# Altium schematic sheet synth.SchDoc: Synthesizer
size Letter; CheckedBy: J. Brinton; CompanyName: Signal Laboratories, Inc.; DrawnBy: J. Brinton; Engineer: J. Brinton; Address1: 3479 Edison Way; Address2: Menlo Park CA 94025; Address3: +1 (877) 778-8435; Address4: siglabs.com; Revision: 3; SheetNumber: 34; SheetTotal: 49
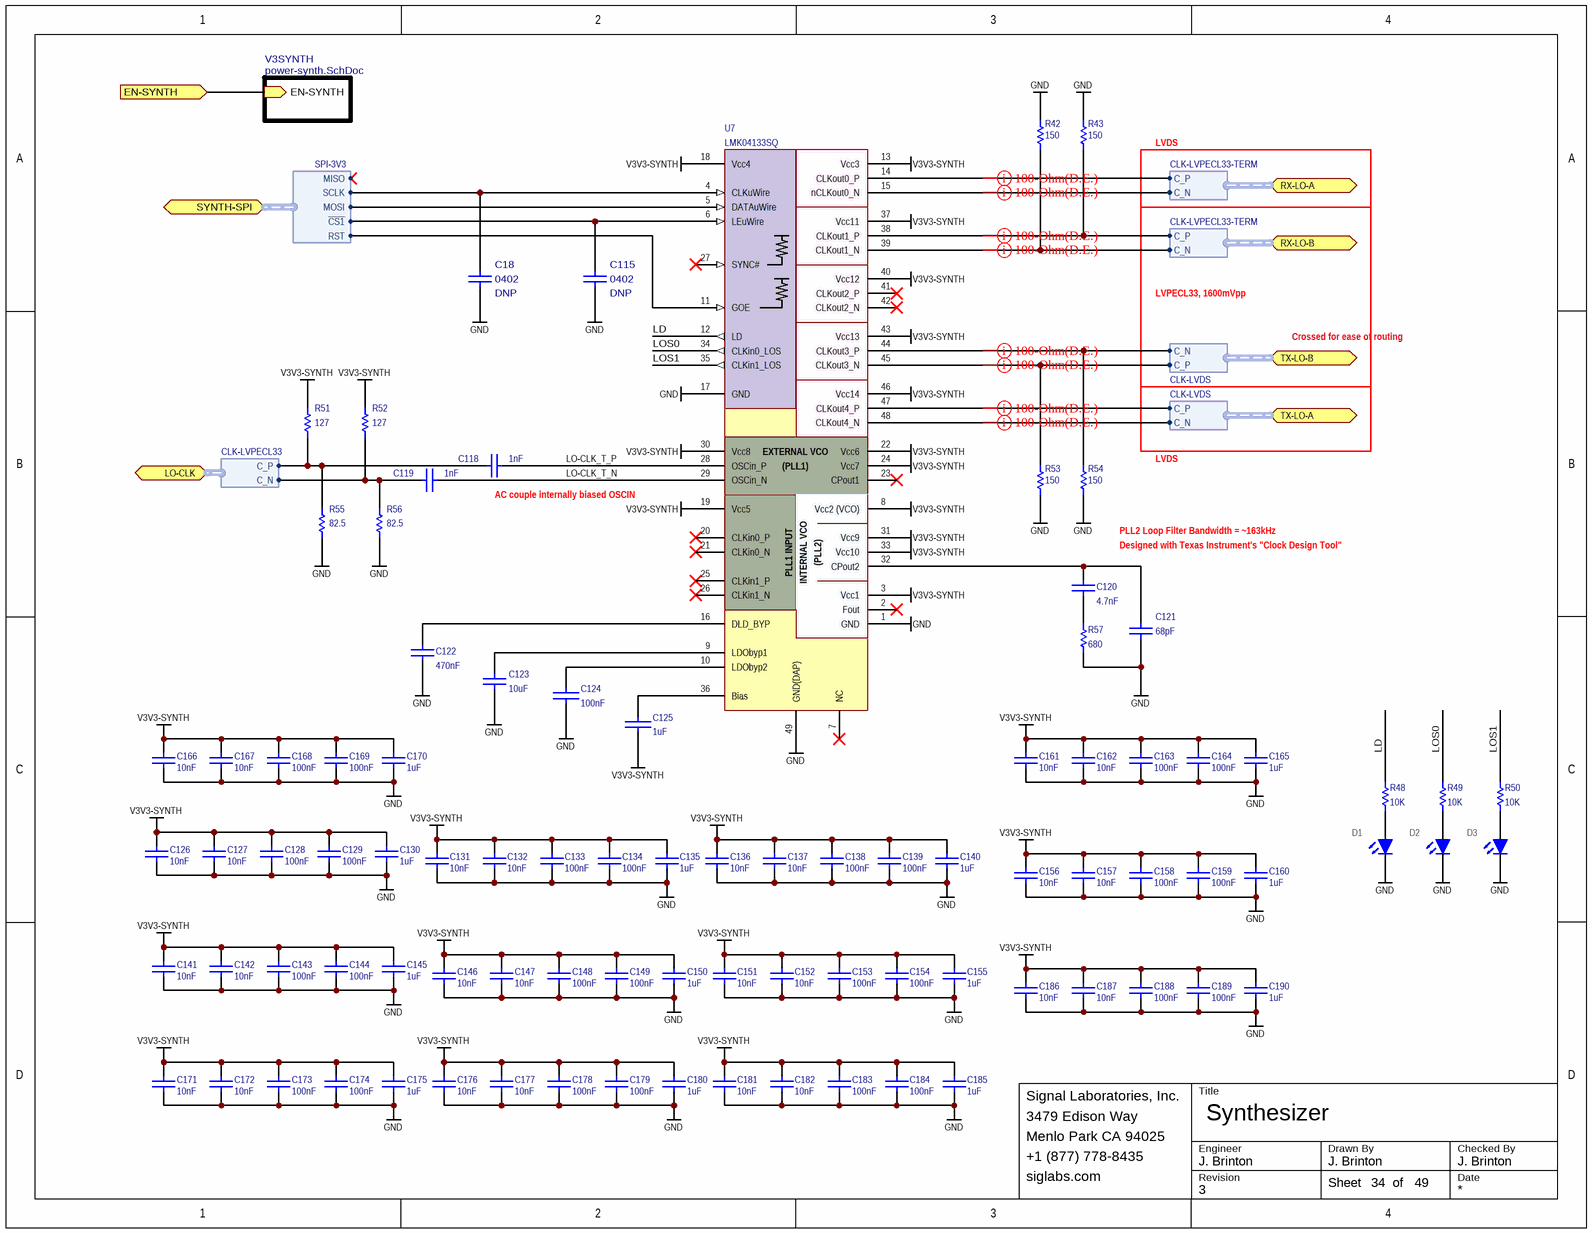
[diagram p0: synth.SchDoc]

## Parts
C18  Package: 0402  Do Not Place: DNP  [CAPC100X50X55L25N]  (hidden comment: VJ0402A101KXA)
C115  Package: 0402  Do Not Place: DNP  [CAPC100X50X55L25N]  (hidden comment: VJ0402A101KXA)
C118  value 1nF  [CAPC100X50X55L25N]  (hidden comment: CGA2B2NP01H102J050BA)
C119  value 1nF  [CAPC100X50X55L25N]  (hidden comment: CGA2B2NP01H102J050BA)
C120  value 4.7nF  [CAPC100X50X55L25N]  (hidden comment: GRM155R71H472JA01D)
C121  value 68pF  [CAPC100X50X55L25N]  (hidden comment: GRM1555C1H680GA01D)
C122  value 470nF  [CAPC200X125X145L45N]  (hidden comment: C0805C474K5RACTU)
C123  value 10uF  [CAPC160X80X90L20N]  (hidden comment: ZRB18AR61E106ME01L)
C124  value 100nF  [CAPC100X50X55L25N]  (hidden comment: GRM155R71C104KA88J)
C125  value 1uF  [CAPC100X50X55L25N]  (hidden comment: GRM155R61A105KE15)
C126  value 10nF  [CAPC100X50X55L25N]  (hidden comment: GRM155R71H103KA88)
C127  value 10nF  [CAPC100X50X55L25N]  (hidden comment: GRM155R71H103KA88)
C128  value 100nF  [CAPC100X50X55L25N]  (hidden comment: GRM155R71C104KA88J)
C129  value 100nF  [CAPC100X50X55L25N]  (hidden comment: GRM155R71C104KA88J)
C130  value 1uF  [CAPC100X50X55L25N]  (hidden comment: GRM155R61A105KE15)
C131  value 10nF  [CAPC100X50X55L25N]  (hidden comment: GRM155R71H103KA88)
C132  value 10nF  [CAPC100X50X55L25N]  (hidden comment: GRM155R71H103KA88)
C133  value 100nF  [CAPC100X50X55L25N]  (hidden comment: GRM155R71C104KA88J)
C134  value 100nF  [CAPC100X50X55L25N]  (hidden comment: GRM155R71C104KA88J)
C135  value 1uF  [CAPC100X50X55L25N]  (hidden comment: GRM155R61A105KE15)
C136  value 10nF  [CAPC100X50X55L25N]  (hidden comment: GRM155R71H103KA88)
C137  value 10nF  [CAPC100X50X55L25N]  (hidden comment: GRM155R71H103KA88)
C138  value 100nF  [CAPC100X50X55L25N]  (hidden comment: GRM155R71C104KA88J)
C139  value 100nF  [CAPC100X50X55L25N]  (hidden comment: GRM155R71C104KA88J)
C140  value 1uF  [CAPC100X50X55L25N]  (hidden comment: GRM155R61A105KE15)
C141  value 10nF  [CAPC100X50X55L25N]  (hidden comment: GRM155R71H103KA88)
C142  value 10nF  [CAPC100X50X55L25N]  (hidden comment: GRM155R71H103KA88)
C143  value 100nF  [CAPC100X50X55L25N]  (hidden comment: GRM155R71C104KA88J)
C144  value 100nF  [CAPC100X50X55L25N]  (hidden comment: GRM155R71C104KA88J)
C145  value 1uF  [CAPC100X50X55L25N]  (hidden comment: GRM155R61A105KE15)
C146  value 10nF  [CAPC100X50X55L25N]  (hidden comment: GRM155R71H103KA88)
C147  value 10nF  [CAPC100X50X55L25N]  (hidden comment: GRM155R71H103KA88)
C148  value 100nF  [CAPC100X50X55L25N]  (hidden comment: GRM155R71C104KA88J)
C149  value 100nF  [CAPC100X50X55L25N]  (hidden comment: GRM155R71C104KA88J)
C150  value 1uF  [CAPC100X50X55L25N]  (hidden comment: GRM155R61A105KE15)
C151  value 10nF  [CAPC100X50X55L25N]  (hidden comment: GRM155R71H103KA88)
C152  value 10nF  [CAPC100X50X55L25N]  (hidden comment: GRM155R71H103KA88)
C153  value 100nF  [CAPC100X50X55L25N]  (hidden comment: GRM155R71C104KA88J)
C154  value 100nF  [CAPC100X50X55L25N]  (hidden comment: GRM155R71C104KA88J)
C155  value 1uF  [CAPC100X50X55L25N]  (hidden comment: GRM155R61A105KE15)
C156  value 10nF  [CAPC100X50X55L25N]  (hidden comment: GRM155R71H103KA88)
C157  value 10nF  [CAPC100X50X55L25N]  (hidden comment: GRM155R71H103KA88)
C158  value 100nF  [CAPC100X50X55L25N]  (hidden comment: GRM155R71C104KA88J)
C159  value 100nF  [CAPC100X50X55L25N]  (hidden comment: GRM155R71C104KA88J)
C160  value 1uF  [CAPC100X50X55L25N]  (hidden comment: GRM155R61A105KE15)
C161  value 10nF  [CAPC100X50X55L25N]  (hidden comment: GRM155R71H103KA88)
C162  value 10nF  [CAPC100X50X55L25N]  (hidden comment: GRM155R71H103KA88)
C163  value 100nF  [CAPC100X50X55L25N]  (hidden comment: GRM155R71C104KA88J)
C164  value 100nF  [CAPC100X50X55L25N]  (hidden comment: GRM155R71C104KA88J)
C165  value 1uF  [CAPC100X50X55L25N]  (hidden comment: GRM155R61A105KE15)
C166  value 10nF  [CAPC100X50X55L25N]  (hidden comment: GRM155R71H103KA88)
C167  value 10nF  [CAPC100X50X55L25N]  (hidden comment: GRM155R71H103KA88)
C168  value 100nF  [CAPC100X50X55L25N]  (hidden comment: GRM155R71C104KA88J)
C169  value 100nF  [CAPC100X50X55L25N]  (hidden comment: GRM155R71C104KA88J)
C170  value 1uF  [CAPC100X50X55L25N]  (hidden comment: GRM155R61A105KE15)
C171  value 10nF  [CAPC100X50X55L25N]  (hidden comment: GRM155R71H103KA88)
C172  value 10nF  [CAPC100X50X55L25N]  (hidden comment: GRM155R71H103KA88)
C173  value 100nF  [CAPC100X50X55L25N]  (hidden comment: GRM155R71C104KA88J)
C174  value 100nF  [CAPC100X50X55L25N]  (hidden comment: GRM155R71C104KA88J)
C175  value 1uF  [CAPC100X50X55L25N]  (hidden comment: GRM155R61A105KE15)
C176  value 10nF  [CAPC100X50X55L25N]  (hidden comment: GRM155R71H103KA88)
C177  value 10nF  [CAPC100X50X55L25N]  (hidden comment: GRM155R71H103KA88)
C178  value 100nF  [CAPC100X50X55L25N]  (hidden comment: GRM155R71C104KA88J)
C179  value 100nF  [CAPC100X50X55L25N]  (hidden comment: GRM155R71C104KA88J)
C180  value 1uF  [CAPC100X50X55L25N]  (hidden comment: GRM155R61A105KE15)
C181  value 10nF  [CAPC100X50X55L25N]  (hidden comment: GRM155R71H103KA88)
C182  value 10nF  [CAPC100X50X55L25N]  (hidden comment: GRM155R71H103KA88)
C183  value 100nF  [CAPC100X50X55L25N]  (hidden comment: GRM155R71C104KA88J)
C184  value 100nF  [CAPC100X50X55L25N]  (hidden comment: GRM155R71C104KA88J)
C185  value 1uF  [CAPC100X50X55L25N]  (hidden comment: GRM155R61A105KE15)
C186  value 10nF  [CAPC100X50X55L25N]  (hidden comment: GRM155R71H103KA88)
C187  value 10nF  [CAPC100X50X55L25N]  (hidden comment: GRM155R71H103KA88)
C188  value 100nF  [CAPC100X50X55L25N]  (hidden comment: GRM155R71C104KA88J)
C189  value 100nF  [CAPC100X50X55L25N]  (hidden comment: GRM155R71C104KA88J)
C190  value 1uF  [CAPC100X50X55L25N]  (hidden comment: GRM155R61A105KE15)
D1  LNJ237W82RA  [0603_LED]  (value not drawn)
D2  LNJ237W82RA  [0603_LED]  (value not drawn)
D3  LNJ237W82RA  [0603_LED]  (value not drawn)
R42  value 150  [RESC1005X40N]  (hidden comment: ERJ-2RKF1500X)
R43  value 150  [RESC1005X40N]  (hidden comment: ERJ-2RKF1500X)
R48  value 10K  [RESC1005X40N]  (hidden comment: ERJ-2RKF1002X)
R49  value 10K  [RESC1005X40N]  (hidden comment: ERJ-2RKF1002X)
R50  value 10K  [RESC1005X40N]  (hidden comment: ERJ-2RKF1002X)
R51  value 127  [RESC1005X40N]  (hidden comment: ERA-2AEB1270X)
R52  value 127  [RESC1005X40N]  (hidden comment: ERA-2AEB1270X)
R53  value 150  [RESC1005X40N]  (hidden comment: ERJ-2RKF1500X)
R54  value 150  [RESC1005X40N]  (hidden comment: ERJ-2RKF1500X)
R55  value 82.5  [RESC1005X40N]  (hidden comment: ERA-2AEB82R5X)
R56  value 82.5  [RESC1005X40N]  (hidden comment: ERA-2AEB82R5X)
R57  value 680  [RESC1005X40N]  (hidden comment: RC0402FR-07680RL)
U7  LMK04133SQ  [RHS]

## Sub-sheets
V3SYNTH = power-synth.SchDoc: EN-SYNTH (in)

## Ports
EN-SYNTH (in), LO-CLK (harness CLK-LVPECL33), RX-LO-A (harness CLK-LVPECL33-TERM), RX-LO-B (harness CLK-LVPECL33-TERM), SYNTH-SPI (harness SPI-3V3), TX-LO-A (harness CLK-LVDS), TX-LO-B (harness CLK-LVDS)

## Harnesses
CLK-LVPECL33: C_P, C_N
CLK-LVPECL33-TERM: C_P, C_N
SPI-3V3: MOSI, MISO, SCLK, ~{CS1}, RST
CLK-LVDS: C_P, C_N

## Nets
GND: C18.2 C115.2 C121.1 C122.1 C123.1 C124.1 C126.1 C127.1 C128.1 C129.1 C130.1 C131.1 C132.1 C133.1 C134.1 C135.1 C136.1 C137.1 C138.1 C139.1 C140.1 C141.1 C142.1 C143.1 C144.1 C145.1 C146.1 C147.1 C148.1 C149.1 C150.1 C151.1 C152.1 C153.1 C154.1 C155.1 C156.1 C157.1 C158.1 C159.1 C160.1 C161.1 C162.1 C163.1 C164.1 C165.1 C166.1 C167.1 C168.1 C169.1 C170.1 C171.1 C172.1 C173.1 C174.1 C175.1 C176.1 C177.1 C178.1 C179.1 C180.1 C181.1 C182.1 C183.1 C184.1 C185.1 C186.1 C187.1 C188.1 C189.1 C190.1 D1.2(K) D2.2(K) D3.2(K) R42.2 R43.2 R53.1 R54.1 R55.1 R56.1 R57.2 U7.1(GND) U7.17(GND) U7.49(GND(DAP))
V3V3-SYNTH: C125.1 C126.2 C127.2 C128.2 C129.2 C130.2 C131.2 C132.2 C133.2 C134.2 C135.2 C136.2 C137.2 C138.2 C139.2 C140.2 C141.2 C142.2 C143.2 C144.2 C145.2 C146.2 C147.2 C148.2 C149.2 C150.2 C151.2 C152.2 C153.2 C154.2 C155.2 C156.2 C157.2 C158.2 C159.2 C160.2 C161.2 C162.2 C163.2 C164.2 C165.2 C166.2 C167.2 C168.2 C169.2 C170.2 C171.2 C172.2 C173.2 C174.2 C175.2 C176.2 C177.2 C178.2 C179.2 C180.2 C181.2 C182.2 C183.2 C184.2 C185.2 C186.2 C187.2 C188.2 C189.2 C190.2 R51.2 R52.2 U7.3(Vcc1) U7.8(Vcc2_(VCO)) U7.13(Vcc3) U7.18(Vcc4) U7.19(Vcc5) U7.22(Vcc6) U7.24(Vcc7) U7.30(Vcc8) U7.31(Vcc9) U7.33(Vcc10) U7.37(Vcc11) U7.40(Vcc12) U7.43(Vcc13) U7.46(Vcc14)
EN-SYNTH: port EN-SYNTH, sheet V3SYNTH/EN-SYNTH
LD: R48.2 U7.12(LD)
LO-CLK_T_N: C119.1 U7.29(OSCin_N)
LO-CLK_T_P: C118.1 U7.28(OSCin_P)
LOS0: R49.2 U7.34(CLKin0_LOS)
LOS1: R50.2 U7.35(CLKin1_LOS)
NetC18_1: C18.1 U7.4(CLKuWire) ; port SYNTH-SPI.SCLK
NetC115_1: C115.1 U7.6(LEuWire) ; port SYNTH-SPI.~{CS1}
NetC118_2: C118.2 R51.1 R55.2 ; port LO-CLK.C_P
NetC119_2: C119.2 R52.1 R56.2 ; port LO-CLK.C_N
NetC120_1: C120.1 R57.1
NetC120_2: C120.2 C121.2 U7.32(CPout2)
NetC122_2: C122.2 U7.16(DLD_BYP)
NetC123_2: C123.2 U7.9(LDObyp1)
NetC124_2: C124.2 U7.10(LDObyp2)
NetC125_2: C125.2 U7.36(Bias)
NetD1_1: D1.1(A) R48.1
NetD2_1: D2.1(A) R49.1
NetD3_1: D3.1(A) R50.1
NetR42_1: R42.1 U7.39(CLKout1_N) ; port RX-LO-B.C_N
NetR43_1: R43.1 U7.38(CLKout1_P) ; port RX-LO-B.C_P
NetR53_2: R53.2 U7.45(CLKout3_N) ; port TX-LO-B.C_P
NetR54_2: R54.2 U7.44(CLKout3_P) ; port TX-LO-B.C_N
NetU7_5: U7.5(DATAuWire) ; port SYNTH-SPI.MOSI
NetU7_11: U7.11(GOE) ; port SYNTH-SPI.RST
NetU7_14: U7.14(CLKout0_P) ; port RX-LO-A.C_P
NetU7_15: U7.15(nCLKout0_N) ; port RX-LO-A.C_N
NetU7_47: U7.47(CLKout4_P) ; port TX-LO-A.C_P
NetU7_48: U7.48(CLKout4_N) ; port TX-LO-A.C_N

Not connected (* = marked no-connect by the designer): U7 2(Fout)* 7(NC)* 20(CLKin0_P)* 21(CLKin0_N)* 23(CPout1)* 25(CLKin1_P)* 26(CLKin1_N)* 27(SYNC#)* 41(CLKout2_P)* 42(CLKout2_N)*

## Layout directives
differential pair; net class z100diff12; Name: 100-Ohm(D.E.): NetR42_1, NetR43_1, NetR53_2, NetR54_2, NetU7_14, NetU7_15, NetU7_47, NetU7_48

## Notes on the sheet
- LVDS
- LVPECL33, 1600mVpp
- Crossed for ease of routing
- (near C118) AC couple internally biased OSCIN
- PLL2 Loop Filter Bandwidth = ~163kHz
- Designed with Texas Instrument's "Clock Design Tool"
- Title
- Engineer
- Revision
- Drawn By
- Checked By
- Date
- Sheet
- of
- (in symbol LMK04133) EXTERNAL VCO; (PLL1); PLL1 INPUT; INTERNAL VCO; (PLL2)

## Library data of the parts
C18 C115 = VJ0402A101JXA: Ceramic Capacitor 100pF ±10% 50V C0G 0402; Manufacturer: Vishay; Tr: -55:150; Manufacturer P/N: VJ0402A101KXA; Tolerance: ±10%; Value: 100pF; Voltage: 50V
C118 C119 = CAP 0402: Ceramic Capacitor 1nF ±5% 50V NP0 0402; Manufacturer: TDK; Tr: -55:150; Voltage: 50V; Manufacturer P/N: CGA2B2NP01H102J050BA; Package: 0402; Tolerance: ±5%
C120 = CAP 0402: Ceramic Capacitor 4.7nF ±5% 50V X7R 0402; Manufacturer: Murata; Tr: -55:125; Voltage: 50V; Manufacturer P/N: GRM155R71H472JA01D; Package: 0402; Tolerance: ±5%
C121 = CAP 0402: Ceramic Capacitor 68pF ±2% 50V NP0 0402; Manufacturer: Murata; Tr: -55:125; Voltage: 50V; Manufacturer P/N: GRM1555C1H680GA01D; Package: 0402; Tolerance: ±2%
C122 = CAP 0402: Ceramic Capacitor 470nF ±10% 50V X7R 0805; Manufacturer: Kemet; Tr: -55:125; Voltage: 50V; Manufacturer P/N: C0805C474K5RACTU; Package: 0805; Tolerance: ±10%
C123 = CAP 0402: Ceramic Capacitor 10uF ±20% 25V X5R 0603; Manufacturer: Murata; Tr: -55:85; Voltage: 25V; Manufacturer P/N: ZRB18AR61E106ME01L; Package: 0603; Tolerance: ±20%
C124 = CAP: Ceramic Capacitor 100nF ±10% 16V X7R 0402; Manufacturer: Murata; Tr: -55:125; Manufacturer P/N: GRM155R71C104KA88J; Voltage: 16V; Package: 0402; Tolerance: ±10%
C125 = CAP: Ceramic Capacitor 1uF ±10% 10V X5R 0402; Manufacturer: Murata; Tr: -55:125; Manufacturer P/N: GRM155R61A105KE15; Package: 0402; Tolerance: ±10%; Voltage: 10V
C126 C127 C131 C132 C136 C137 C141 C142 C146 C147 C151 C152 C156 C157 C161 C162 C166 C167 C171 C172 C176 C177 C181 C182 C186 C187 = CAP 0402: Ceramic Capacitor 10nF ±10% 50V X7R 0402; Manufacturer: Murata; Tr: -55:125; Voltage: 50V; Manufacturer P/N: GRM155R71H103KA88; Package: 0402; Tolerance: ±10%
C128 C129 C133 C134 C138 C139 C143 C144 C148 C149 C153 C154 C158 C159 C163 C164 C168 C169 C173 C174 C178 C179 C183 C184 C188 C189 = CAP 0402: Ceramic Capacitor 100nF ±10% 16V X7R 0402; Manufacturer: Murata; Tr: -55:125; Voltage: 16V; Manufacturer P/N: GRM155R71C104KA88J; Package: 0402; Tolerance: ±10%
C130 C135 C140 C145 C150 C155 C160 C165 C170 C175 C180 C185 C190 = CAP 0402: Ceramic Capacitor 1uF ±10% 10V X5R 0402; Manufacturer: Murata; Tr: -55:125; Voltage: 10V; Manufacturer P/N: GRM155R61A105KE15; Package: 0402; Tolerance: ±10%
D1-D3 = LED0603Y: LED, SMT 0603, Color Red, 10mA, 2.05V; Manufacturer: Panasonic; Manufacturer P/N: LNJ237W82RA; Package: 0603 Polarized
R42 R43 R53 R54 = RES 0402: Thick Film 150 ±1% 0402; Manufacturer: Panasonic; Tr: -55:155; Package: 0402; Manufacturer P/N: ERJ-2RKF1500X; Do Not Place: *; Tolerance: ±1%
R48-R50 = RES 0402: Thick Film Resistor 10k ±1% 0.1W 50V 0402; Manufacturer: Panasonic; Tr: -55:155; Package: 0402; Manufacturer P/N: ERJ-2RKF1002X; Tolerance: ±1%
R51 R52 = RES 0402: Thin Film Resistor 127 ±0.1% 0402; Manufacturer: Panasonic; Tr: -55:155; Package: 0402; Manufacturer P/N: ERA-2AEB1270X; Do Not Place: *; Tolerance: ±0.1%
R55 R56 = RES 0402: Thin Film Resistor 82.5 ±0.1% 0402; Manufacturer: Panasonic; Tr: -55:155; Package: 0402; Manufacturer P/N: ERA-2AEB82R5X; Do Not Place: *; Tolerance: ±0.1%
R57 = RES 0402: Thick Film Resistor 680 ±1% 0402; Manufacturer: Yageo; Tr: -55:155; Manufacturer P/N: RC0402FR-07680RL; Do Not Place: *; Package: 0402; Tolerance: ±1%
U7 = LMK04133: Clock Jitter Cleaner with Cascaded PLLs; Manufacturer: Texas Instruments; Manufacturer P/N: LMK04133SQ